# EAGLE design Meter-Daughterboard-input-v21AM (EAGLE 5.10)
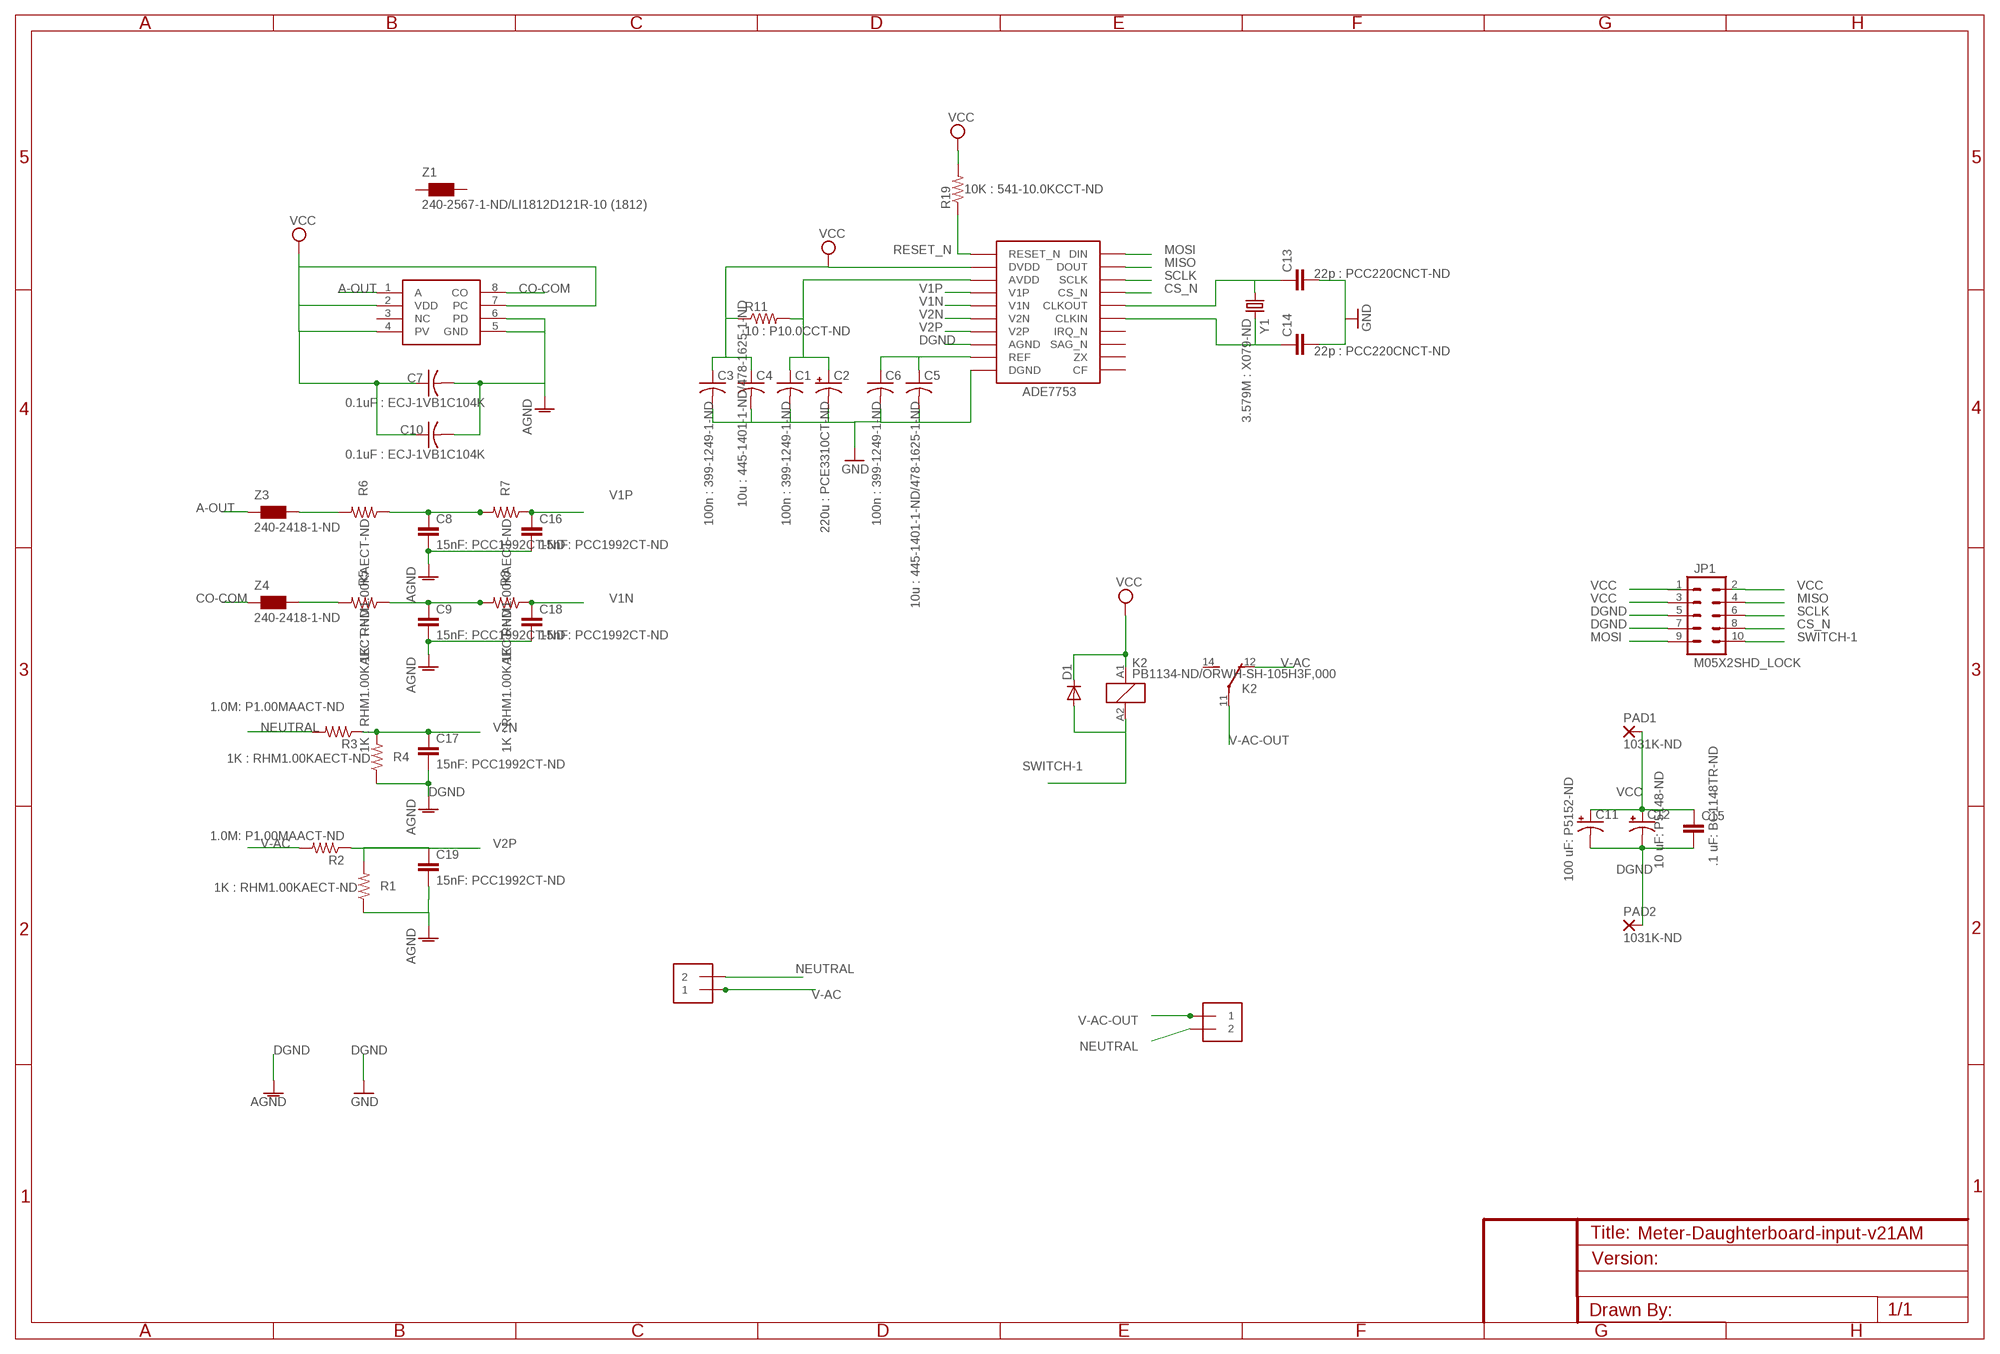
[diagram p0: schematic, sheet 1]

## Parts
ADE7753  ADE7753ARSZ-ND  ADE7753  [SSOP20]
C1  100n : 399-1249-1-ND  C-USC1206  [C1206]
C2  220u : PCE3310CT-ND  CPOL-USD  [PANASONIC_D]
C3  100n : 399-1249-1-ND  C-USC1206  [C1206]
C4  10u : 445-1401-1-ND/478-1625-1-ND  C-USC1210  [C1210]
C5  10u : 445-1401-1-ND/478-1625-1-ND  C-USC1210  [C1210]
C6  100n : 399-1249-1-ND  C-USC1206  [C1206]
C7  0.1uF : ECJ-1VB1C104K  C-USC0603  [C0603]
C8  15nF: PCC1992CT-ND  CAP0805  [0805]
C9  15nF: PCC1992CT-ND  CAP0805  [0805]
C10  0.1uF : ECJ-1VB1C104K  C-USC0603  [C0603]
C11  100 uF: P5152-ND  CAP_POLPTH1  [CPOL-RADIAL-100UF-25V]
C12  10 uF: P5148-ND  CAP_POLPTH2  [CPOL-RADIAL-10UF-25V]
C13  22p : PCC220CNCT-ND  CAP0805  [0805]
C14  22p : PCC220CNCT-ND  CAP0805  [0805]
C15  .1 uF: BC1148TR-ND  CAPPTH  [CAP-PTH-SMALL]
C16  15nF: PCC1992CT-ND  CAP0805  [0805]
C17  15nF: PCC1992CT-ND  CAP0805  [0805]
C18  15nF: PCC1992CT-ND  CAP0805  [0805]
C19  15nF: PCC1992CT-ND  CAP0805  [0805]
CSA-1V  CSA-1V  [SOIC8]
D1  DIODE1N4148  [DIODE-1N4148]
J1  1X2-3.5MM  [3.5MMTERM]
J2  1X2-3.5MM  [3.5MMTERM]
JP1  M05X2SHD_LOCK  [2X5-SHROUDED_LOCK]
K2  PB1134-ND/ORWH-SH-105H3F,000  ZNS5106  [ZN5]
PAD1  1031K-ND  2,54/0,9  [2,54/0,9]
PAD2  1031K-ND  2,54/0,9  [2,54/0,9]
R1  1K : RHM1.00KAECT-ND  R-US_R0805  [R0805]
R2  1.0M: P1.00MAACT-ND  R-US_R1210  [R1210]
R3  1.0M: P1.00MAACT-ND  R-US_R1210  [R1210]
R4  1K : RHM1.00KAECT-ND  R-US_R0805  [R0805]
R5  1K : RHM1.00KAECT-ND  R-US_R0805  [R0805]
R6  1K : RHM1.00KAECT-ND  R-US_R0805  [R0805]
R7  1K : RHM1.00KAECT-ND  R-US_R0805  [R0805]
R8  1K : RHM1.00KAECT-ND  R-US_R0805  [R0805]
R11  10 : P10.0CCT-ND  R-US_R0805  [R0805]
R19  10K : 541-10.0KCCT-ND  R-US_R0805  [R0805]
Y1  3.579M : X079-ND  CRYSTALHC49S  [HC49/S]
Z1  240-2567-1-ND/LI1812D121R-10 (1812)  WE-CBF_1812  [1812]
Z3  240-2418-1-ND  WE-CBF_1806  [1806]
Z4  240-2418-1-ND  WE-CBF_1806  [1806]

## Nets
A-OUT: CSA-1V.1(A) Z3.1
AVDD: ADE7753.3(AVDD) C1.1 C2.+ R11.2
CO-COM: CSA-1V.8(CO) Z4.1
CS_N: ADE7753.17(CS_N) JP1.8
DGND: ADE7753.8(AGND) ADE7753.10(DGND) C1.2 C2.- C3.2 C4.2 C5.2 C6.2 C7.2 C8.2 C9.2 C10.2 C11.2(-) C12.2(-) C13.2 C14.2 C15.2 C16.2 C17.2 C18.2 C19.2 CSA-1V.5(GND) CSA-1V.6(PD) JP1.5 JP1.7 PAD2.1(P) R1.1 R4.1 ; supply symbol labelled GND, AGND
MISO: ADE7753.19(DOUT) JP1.4
MOSI: ADE7753.20(DIN) JP1.9
N$1: R6.2 Z3.2
N$3: R5.2 Z4.2
N$10: ADE7753.16(CLKOUT) C13.1 Y1.1
N$11: ADE7753.15(CLKIN) C14.1 Y1.2
NEUTRAL: J1.2 J2.2 R3.2
REF: ADE7753.9(REF) C5.1 C6.1
RESET_N: ADE7753.1(RESET_N) R19.1
SCLK: ADE7753.18(SCLK) JP1.6
SWITCH-1: D1.A JP1.10 K2.A2
V1N: ADE7753.5(V1N) C18.1 R8.1
V1NPRE: C9.1 R5.1 R8.2
V1P: ADE7753.4(V1P) C16.1 R7.1
V1PPRE: C8.1 R6.1 R7.2
V2N: ADE7753.6(V2N) C17.1 R3.1 R4.2
V2P: ADE7753.7(V2P) C19.1 R1.2 R2.1
V-AC: J1.1 K2.12(2:O) R2.2
V-AC-OUT: J2.1 K2.11(2:P)
VCC: ADE7753.2(DVDD) C3.1 C4.1 C7.1 C10.1 C11.1(+) C12.1(+) C15.1 CSA-1V.2(VDD) CSA-1V.4(PV) CSA-1V.7(PC) D1.C JP1.1 JP1.2 JP1.3 K2.A1 PAD1.1(P) R11.1 R19.2
Unconnected: ADE7753.11(CF) ADE7753.12(ZX) ADE7753.13(SAG_N) ADE7753.14(IRQ_N) CSA-1V.3(NC) K2.14(2:S) Z1.1 Z1.2

## Library data of the parts
ADE7753 = ACMeterEagle:ADE7753
C1 C3-C7 C10 = rcl:C-US: CAPACITOR, American symbol
C2 = rcl:CPOL-US: POLARIZED CAPACITOR, American symbol
C8 C9 C13 C14 C16-C19 = SparkFunEagle-6-6-07:CAP: Capacitor Standard 0603 ceramic capacitor, and 0.1" leaded capacitor.
C11 C12 = SparkFun:CAP_POL: Capacitor Polarized These are standard SMD and PTH capacitors. Normally 10uF, 47uF, and 100uF in electrolytic and tantalum varieties. Always verify the external diameter of the through hole cap, it varies with capacity, voltage, and manufacturer. The EIA devices should be standard.
C15 = SparkFun:CAP: Capacitor Standard 0603 ceramic capacitor, and 0.1" leaded capacitor.
CSA-1V = ACMeterEagle:CSA-1V
D1 = SparkFun:DIODE: Diode These are standard reverse protection diodes and small signal diodes. SMA package can handle up to about 1A. SOD-323 can handle about 200mA. What the SOD-323 package when ordering, there are some mfgs out there that are 5-pin packages.
J1 J2 = adafruit:1X2: 3.5mm Terminal block http://www.ladyada.net/library/pcb/eaglelibrary.html
JP1 = SparkFun:M05X2: Header 5x2 Standard 10-pin dual row 0.1" header. Commonly used with AVR-ISP. Use with Spark Fun Electronics SKU: PRT-00778
K2 = relay:ZNS5*: Miniature Power PCB Relay SCHRACK 1pole 10 A Source: http://www.schrack.com/.. 5847.pdf
PAD1 PAD2 = wirepad:2,54/0,9: THROUGH-HOLE PAD
R1 R4-R8 = resistor:R-US_: RESISTOR, American symbol
R2 R3 = adafruit:R-US_: RESISTOR, American symbol
R11 R19 = rcl:R-US_: RESISTOR, American symbol
Y1 = crystal:CRYSTAL: CRYSTAL
Z1 Z3 Z4 = wuerth-elektronik:WE-CBF: SMD EMI Suppression Ferrite Beads - excellent anti-EMI properties - low DCR - impedances till 3000 ohms - rated current up to 6 A

## Board
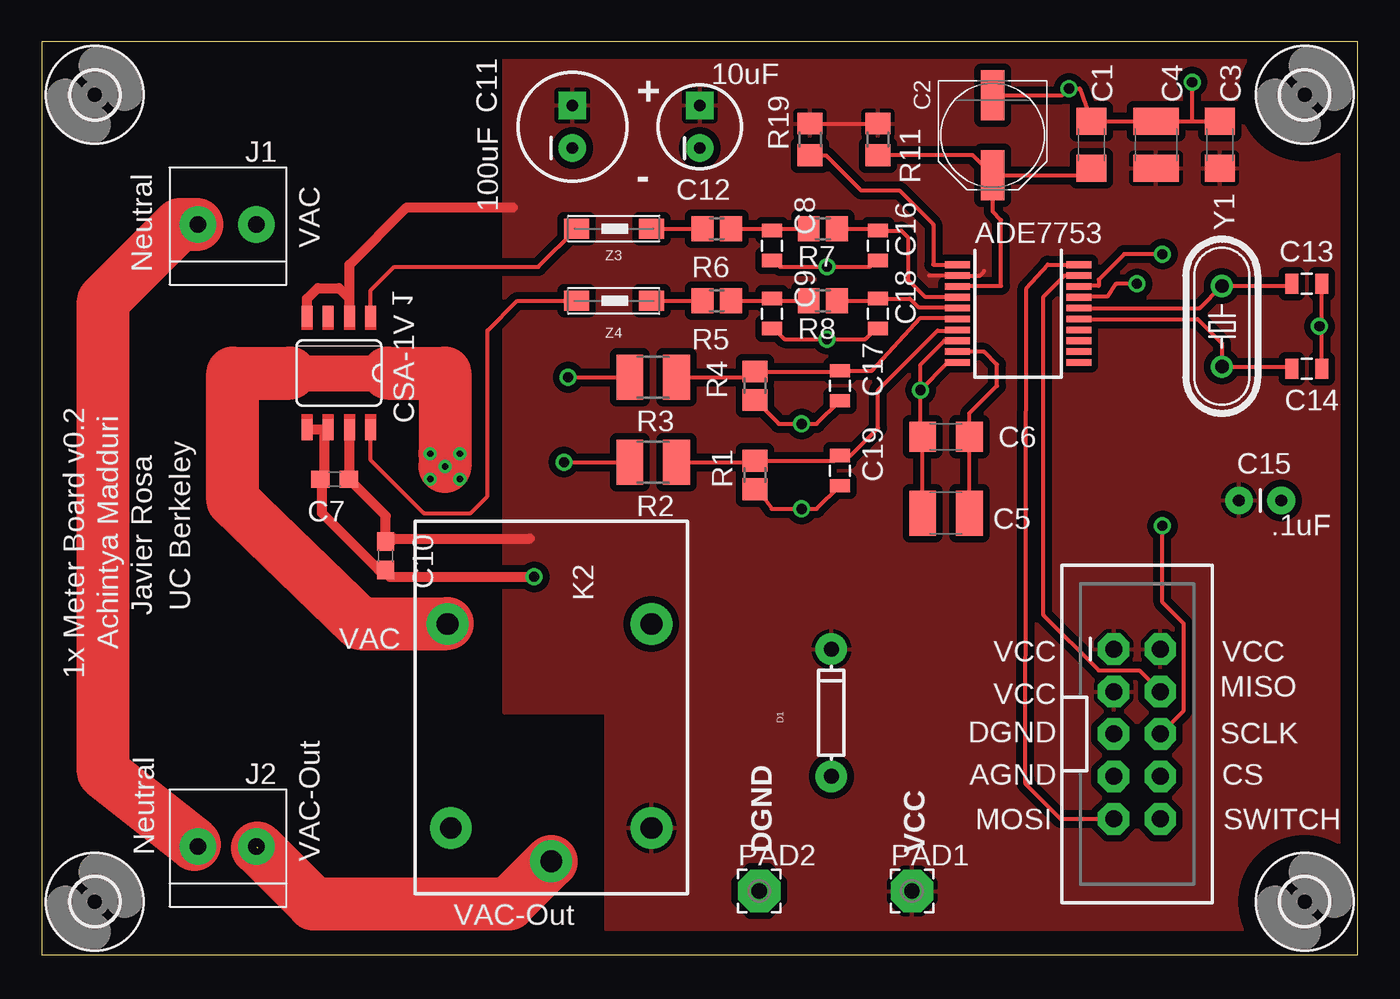
[diagram p1: board, top side]
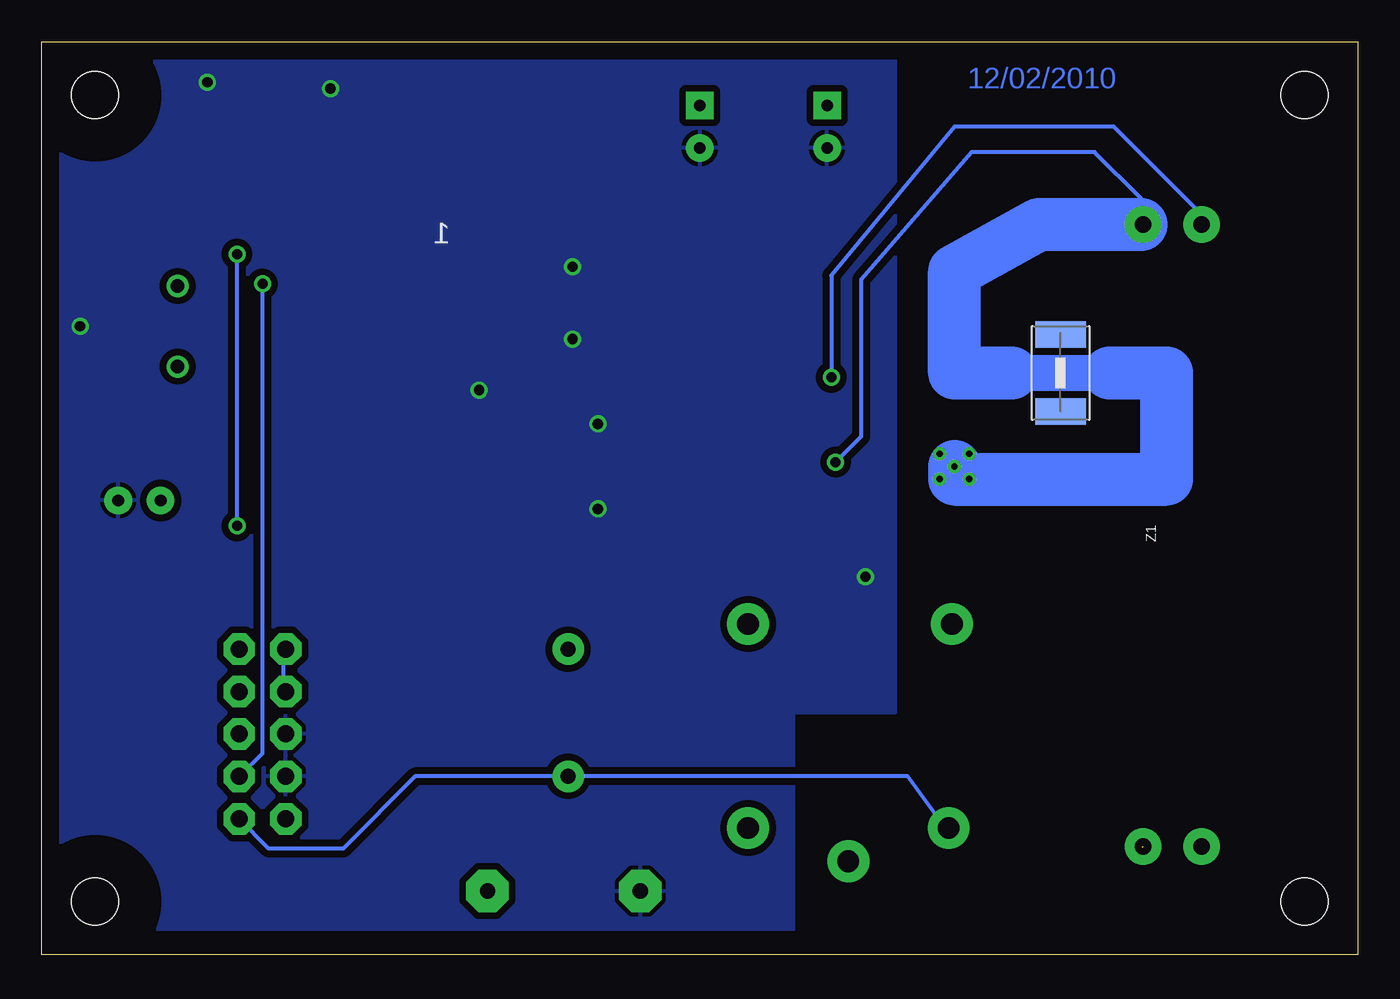
[diagram p2: board, bottom side, seen from below]

Size 78.74 x 54.61 mm. Coordinates in mm from the lower left corner, seen from the top.
Outline: 0,0 78.74,0 78.74,54.61 0,54.61 0,0
Copper layers (1*16): Top 0.035mm / dielectric 1.5mm / Bottom 0.035mm
Design rules "default *": minimum track width 10mil, minimum drill 15mil, track to track 8mil, track to pad 8mil, pad to pad 8mil, via to via 8mil, smd to smd 8mil, copper to edge 40mil, drill to drill 8mil, minimum pad ring 10mil, minimum via ring 8mil, stop-mask expansion 4mil, vias tented up to drill 0mil, thermal gap 10mil

### Footprints (pad centres in the part's own frame; a part is rotated, then mirrored left to right if it is on the bottom)
SSOP20 = smd 0.4 x 1.5: 1 -2.925,-3.625; 2 -2.275,-3.625; 3 -1.625,-3.625; 4 -0.975,-3.625; 5 -0.325,-3.625; 6 0.325,-3.625; 7 0.975,-3.625; 8 1.625,-3.625; 9 2.275,-3.625; 10 2.925,-3.625; 11 2.925,3.625; 12 2.275,3.625; 13 1.625,3.625; 14 0.975,3.625; 15 0.325,3.625; 16 -0.325,3.625; 17 -0.975,3.625; 18 -1.625,3.625; 19 -2.275,3.625; 20 -2.925,3.625
C1206 = smd 1.6 x 1.8: 1 -1.4,0; 2 1.4,0
PANASONIC_D = smd 3 x 1.4: + 2.4,0; - -2.4,0
C1210 = smd 1.6 x 2.7: 1 -1.4,0; 2 1.4,0
C0603 = smd 1.1 x 1: 1 -0.85,0; 2 0.85,0
0805 = smd 0.8 x 1.2: 1 -0.9,0; 2 0.9,0
CPOL-RADIAL-100UF-25V = drill 0.7 pad 1.651 square: 1 1.27,0 | drill 0.7 pad 1.651 round: 2 -1.27,0
CPOL-RADIAL-10UF-25V = drill 0.7 pad 1.651 square: 1 1.27,0 | drill 0.7 pad 1.651 round: 2 -1.27,0
CAP-PTH-SMALL = drill 0.7 pad 1.651 round: 1 0,0; 2 2.54,0
SOIC8 = smd 0.66 x 1.27: 1 -1.905,-3.391; 2 -0.635,-3.391; 3 0.635,-3.391; 4 1.905,-3.391; 5 1.905,3.391; 6 0.635,3.391; 7 -0.635,3.391; 8 -1.905,3.391
DIODE-1N4148 = drill 0.9 pad 1.88 round: A -3.81,0; C 3.81,0
3.5MMTERM = drill 1 pad 2.184 round: 1 1.8,0; 2 -1.7,0
2X5-SHROUDED_LOCK = drill 1.016 pad 1.88 octagon: 1 -1.397,5.08; 2 1.397,5.08; 3 -1.397,2.54; 4 1.397,2.54; 5 -1.397,0; 6 1.397,0; 7 -1.397,-2.54; 8 1.397,-2.54; 9 -1.397,-5.08; 10 1.397,-5.08
ZN5 = drill 1.3 pad 2.5 round: 11 8.89,0; 12 -5.31,-6.2; 14 -5.31,6; A1 6.89,6; A2 6.89,-6
2,54/0,9 = drill 0.914 pad 2.54 octagon: 1 0,0
R0805 = smd 1.3 x 1.5: 1 -0.85,0; 2 0.85,0
R1210 = smd 1.6 x 2.7: 1 -1.4,0; 2 1.4,0
R0805' = smd 1.3 x 1.5: 1 -0.95,0; 2 0.95,0
2,8 = hole 2.8: 0,0
HC49/S = drill 0.813 round: 1 -2.413,0; 2 2.413,0
1812 = smd 1.6 x 3: 1 -2.3,0; 2 2.3,0
1806 = smd 1.5 x 1.2: 1 -2.3,0; 2 2.2,0

### Placement (x,y rotation side)
ADE7753  58.42,38.35 270 top
C1  62.8,48.45 90 top
C2  56.9,49.02 270 top
C3  70.48,48.45 90 top
C4  66.67,48.45 90 top
C5  54.1,26.42 180 top
C6  54.1,30.99 180 top
C7  17.53,28.45 180 top
C8  43.69,42.42 270 top
C9  43.69,38.35 270 top
C10  20.57,23.88 270 top
C11  31.75,49.53 90 top
C12  39.37,49.53 90 top
C13  75.69,40.13 0 top
C14  75.69,35.05 0 top
C15  71.63,27.18 0 top
C16  50.04,42.42 270 top
C17  47.75,34.04 270 top
C18  50.04,38.35 270 top
C19  47.75,28.96 270 top
CSA-1V  17.78,34.8 180 top
D1  47.24,14.48 90 top
J1  11.05,43.69 0 top
J2  11.05,6.48 0 top
JP1  65.53,13.21 0 top
K2  30.48,14.48 270 top
PAD1  52.07,3.81 0 top
PAD2  42.93,3.81 0 top
R1  42.67,28.7 90 top
R2  36.58,29.46 180 top
R3  36.58,34.54 180 top
R4  42.67,34.04 90 top
R5  40.39,39.12 180 top
R6  40.39,43.43 180 top
R7  46.74,43.43 180 top
R8  46.74,39.12 180 top
R11  10 : P10.0CCT-ND  [R0805']  50.04,48.77 270 top
R19  10K : 541-10.0KCCT-ND  [R0805']  45.97,48.77 90 top
U$1  [2,8]  3.17,51.44 0 top
U$2  [2,8]  3.17,3.17 0 top
U$3  [2,8]  75.56,51.44 0 top
U$4  [2,8]  75.56,3.17 0 top
Y1  70.61,37.59 270 top
Z1  17.78,34.8 90 bottom
Z3  34.29,43.43 0 top
Z4  34.29,39.12 0 top

### Tracks (layer width: path | path; a pad name or v marks a point on that pad's centre or on a via)
A-OUT
  Top 0.254: CSA-1V.1 19.68,39.75 21.08,41.15 29.7,41.15 Z3.1
AVDD
  Top 0.254: R11.2 55.7,47.82 C2.+ | C2.+ 63.01,46.62 C1.1 | C2.+ 56.9,44.45 57.4,43.94 57.4,40.01 54.95,40.01 ADE7753.3
CO-COM
  Top 0.254: CSA-1V.8 19.68,29.59 22.86,26.42 25.65,26.42 26.67,27.43 26.67,37.34 28.45,39.12 Z4.1
CS_N  (via drill 0.61)
  Top 0.254: v65.53,40.13 64.26,40.13 63.75,39.37 62.09,39.37 ADE7753.17
  Bottom 0.254: v65.53,40.13 65.53,12.06 JP1.8
DGND  (via drill 0.61)
  Top 0.254: C14.2 76.59,37.59 | 76.59,37.59 C13.2 | 16.93,31.19 CSA-1V.6 | ADE7753.10 54.23,35.43 v52.58,33.78 | 76.59,37.59 v76.45,37.59 | ADE7753.8 54,36.73 52.58,35.31 v52.58,33.78 | C6.2 53.34,30.99 | C5.2 C6.2 | 16.93,28.7 C7.2 16.76,28.36 | R4.1 44.11,31.75 v45.47,31.75 46.37,31.75 C17.2 | R1.1 42.76,27.85 42.93,27.69 43.69,26.67 v45.47,26.67 46.37,26.67 C19.2 | C2.- 61.07,51.42 v61.47,51.82 62.11,51.82 C1.2 C4.2 C3.2 | v52.58,33.78 52.58,31.11 C6.2 | v68.83,52.2 68.83,49.91 68.9,49.85 C3.2 | C9.2 43.83,37.45 44.45,36.83 v46.99,36.83 49.28,36.83 49.9,37.45 C18.2 | C8.2 43.83,41.52 44.2,41.15 v46.99,41.15 49.53,41.15 49.9,41.52 C16.2
  Top 0.61: CSA-1V.6 CSA-1V.5 | v29.46,22.61 20.83,22.61 20.57,22.86 C10.2 20.15,23.03 16.76,26.42 16.76,28.36 | 16.93,28.7 16.93,31.19
  pour Bottom (isolate 0.406): 77.98,53.59 27.69,53.59 27.69,14.48 33.78,14.48 33.78,1.52 77.98,1.52
MISO
  Top 0.254: ADE7753.19 62.03,40.64 61.21,40.64 59.94,39.37 59.94,20.32 63.25,17.02 65.66,17.02 JP1.4
MOSI
  Top 0.254: ADE7753.20 61.91,41.27 60.2,41.27 58.93,39.88 58.86,10.54 58.86,10.22 60.96,8.13 JP1.9
N$1
  Top 0.254: Z3.2 R6.2
N$3
  Top 0.254: Z4.2 R5.2
N$10
  Top 0.254: C13.1 74.67,40.01 Y1.1 69.29,38.68 ADE7753.16
N$11
  Top 0.254: C14.1 74.67,35.18 Y1.2 70.61,36.58 69.16,38.03 ADE7753.15
NEUTRAL  (via drill 0.61)
  Top 0.254: v31.5,34.54 R3.2 | 9.27,43.69 J1.2 10.54,43.69 | J2.2 9.14,6.48 9.14,6.6
  Top 3.175: 9.27,43.69 8.26,43.69 3.68,39.12 3.68,10.92 9.14,6.6
  Bottom 0.254: v31.5,34.54 31.5,40.64 24.13,49.53 14.61,49.53 9.4,44.32 9.4,43.69 J1.2
REF
  Top 0.254: C5.1 C6.1 55.5,32.39 57.15,34.04 57.15,35.31 56.39,36.07 54.81,36.07 ADE7753.9
RESET_N
  Top 0.254: ADE7753.1 54.67,41.27 53.34,41.27 53.34,43.69 51.31,45.72 49.02,45.72 46.92,47.82 R19.1
SCLK  (via drill 0.61)
  Top 0.254: v67.06,41.91 64.77,41.91 63.25,40.39 63.25,40.01 62.15,40.01 ADE7753.18 | v67.06,25.65 67.06,21.08 68.33,19.81 68.33,14.61 JP1.6
  Bottom 0.254: v67.06,25.65 v67.06,41.91
SWITCH-1
  Bottom 0.254: K2.A2 24.67,7.59 26.92,10.67 D1.A 56.39,10.67 60.71,6.35 65.15,6.35 JP1.10
V1N
  Top 0.254: ADE7753.5 54.85,38.73 52.45,38.73 51.93,39.25 C18.1 50.04,39.12 R8.1
V1NPRE
  Top 0.254: R5.1 43.55,39.12 C9.1 43.69,39.12 R8.2
V1P
  Top 0.254: ADE7753.4 54.75,39.37 52.83,39.37 51.82,40.39 51.82,42.93 51.42,43.32 C16.1 | C16.1 49.92,43.43 | R7.1 50.04,43.43 C16.1
V1PPRE
  Top 0.254: R6.1 43.3,43.43 C8.1 43.69,43.43 R7.2
V2N
  Top 0.254: R3.1 42.33,34.54 R4.2 47.7,34.89 C17.1 49.67,34.94 52.58,38.1 54.61,38.1 ADE7753.6
V2P
  Top 0.254: R2.1 42.51,29.46 R1.2 47.45,29.55 C19.1 48.4,29.86 50.04,31.5 50.04,33.78 53.59,37.34 54.75,37.34 ADE7753.7
V-AC  (via drill 0.38, 0.61)
  Top 0.254: 24.26,19.81 K2.12 | v31.24,29.46 R2.2 | v25.02,28.45 25.15,28.45 v24.13,29.21 | v23.24,29.97 24.13,29.97 v25.02,29.97 25.15,29.97
  Top 2.159: 14.86,34.8 20.7,34.8
  Top 3.175: v24.13,29.21 24.13,29.97 24.13,34.8 20.7,34.8 | 14.86,34.8 11.43,34.8 11.43,27.18 19.05,19.81 24.26,19.81
  Bottom 0.254: v31.24,29.46 29.72,30.99 29.72,40.39 23.11,48.01 15.75,48.01 12.95,45.21 12.95,43.69 J1.1
  Bottom 2.159: 14.86,34.8 20.7,34.8
  Bottom 3.175: 12.95,43.69 19.05,43.69 24.13,40.89 24.13,34.8 20.7,34.8 | v24.13,29.21 24.13,28.45 v23.24,28.45 11.43,28.45 11.43,34.8 14.86,34.8
V-AC-OUT  (1 unrouted)
  Top 3.175: 12.91,6.39 16.26,3.05 27.94,3.05 K2.11
VCC
  Top 0.254: 18.29,39.37 18.29,38.32 CSA-1V.2 | C7.1 18.41,28.49 | C10.1 20.92,24.73 | R19.2 R11.1 | ADE7753.2 56.12,40.63 56.39,40.89 | 53.09,40.64 54.61,40.64
  Top 0.61: 29.21,24.89 21.08,24.89 20.92,24.73 | CSA-1V.4 15.88,39.24 16.51,39.88 17.78,39.88 18.29,39.37 | 18.41,28.49 CSA-1V.7 | C10.1 20.57,26.25 C7.1 | CSA-1V.2 18.41,41.27 21.84,44.7 28.19,44.7
  Bottom 0.254: JP1.3 64.26,15.75 64.26,18.29 JP1.1
  pour Top (isolate 0.406): 77.98,53.59 77.98,1.52 33.78,1.52 33.78,14.48 27.69,14.48 27.69,53.59
(copper drawn outside any net)
  shapes: Top area x8

### Text on the board
Bottom: 12/02/2010
tPlace: + | Neutral | - | VAC | UC Berkeley | Javier Rosa | VCC | Achintya Madduri | VAC | VCC | 1x Meter Board v0.2 | VCC | MISO | DGND | SCLK | AGND | CS | MOSI | SWITCH | Neutral | VAC-Out | DGND | VCC | VAC-Out
tNames: 10uF | 100uF | 1 | .1uF
bNames: 1
_tsilk: 10uF | C2 | Neutral | + | C1 | C4 | C3 | 100uF | C11 | R11 | VAC | R19 | - | C12 | C8 | Y1 | ADE7753 | Z3 | R6 | C9 | C13 | 1 | PWR_INPUT | CSA-1V | Z4 | R5 | C17 | R3 | R4 | C14 | C19 | C6 | C15 | R1 | C7 | R2 | C5 | .1uF | C10 | K2 | MISO | VCC | VAC | INTERFACE | SCLK | DGND | D1 | CS | AGND | PWR_OUT | SWITCH | MOSI | VAC-Out | PAD2 | PAD1 | Neutral | VAC-Out | DGND | VCC
_bsilk: 1 | FERRITE-DIGIKEY:240-2567-1-ND